# EAGLE design Steering_Board (EAGLE 9.6.2)
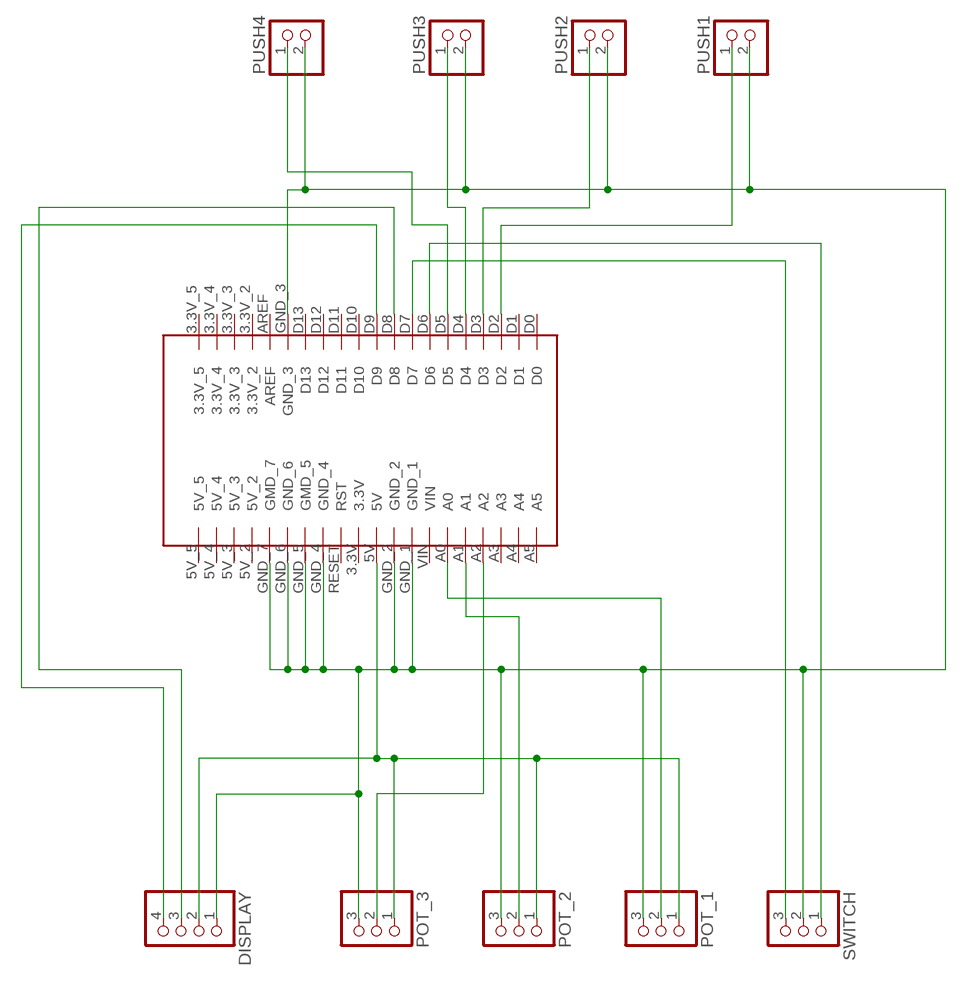
[diagram p0: schematic, sheet 1]

## Parts
2X40CONECTOR1  2X40_CONNECTOR  [2X40_PIN_CONNECTOR]
DISPLAY  PINHD-1X4  [1X04]
POT_1  PINHD-1X3  [1X03]
POT_2  PINHD-1X3  [1X03]
POT_3  PINHD-1X3  [1X03]
PUSH1  PINHD-1X2  [1X02]
PUSH2  PINHD-1X2  [1X02]
PUSH3  PINHD-1X2  [1X02]
PUSH4  PINHD-1X2  [1X02]
SWITCH  PINHD-1X3  [1X03]

## Nets
5V [GND, 5V]: 2X40CONECTOR1.5V DISPLAY.2 POT_1.1 POT_2.1 POT_3.1
DISPLAY_D8: 2X40CONECTOR1.D8 DISPLAY.3
DISPLAY_D9: 2X40CONECTOR1.D9 DISPLAY.4
GND [GND, 5V]: 2X40CONECTOR1.GND_1 2X40CONECTOR1.GND_2 2X40CONECTOR1.GND_3 2X40CONECTOR1.GND_4 2X40CONECTOR1.GND_5(GMD_5) 2X40CONECTOR1.GND_6 2X40CONECTOR1.GND_7(GMD_7) DISPLAY.1 POT_1.3 POT_2.3 POT_3.3 PUSH1.2 PUSH2.2 PUSH3.2 PUSH4.2 SWITCH.2
POT3_A2: 2X40CONECTOR1.A2 POT_3.2
POTEN1_A0: 2X40CONECTOR1.A0 POT_1.2
POTEN2_A1: 2X40CONECTOR1.A1 POT_2.2
PUSH1_D2: 2X40CONECTOR1.D2 PUSH1.1
PUSH2_D3: 2X40CONECTOR1.D3 PUSH2.1
PUSH3_D4: 2X40CONECTOR1.D4 PUSH3.1
PUSH4_D5: 2X40CONECTOR1.D5 PUSH4.1
SWITCH_D6: 2X40CONECTOR1.D6 SWITCH.1
SWITCH_D7: 2X40CONECTOR1.D7 SWITCH.3
Unconnected: 2X40CONECTOR1.3.3V 2X40CONECTOR1.3.3V_2 2X40CONECTOR1.3.3V_3 2X40CONECTOR1.3.3V_4 2X40CONECTOR1.3.3V_5 2X40CONECTOR1.5V_2 2X40CONECTOR1.5V_3 2X40CONECTOR1.5V_4 2X40CONECTOR1.5V_5 2X40CONECTOR1.A3 2X40CONECTOR1.A4 2X40CONECTOR1.A5 2X40CONECTOR1.AREF 2X40CONECTOR1.D0 2X40CONECTOR1.D1 2X40CONECTOR1.D10 2X40CONECTOR1.D11 2X40CONECTOR1.D12 2X40CONECTOR1.D13 2X40CONECTOR1.RESET(RST) 2X40CONECTOR1.VIN

## Library data of the parts
2X40CONECTOR1 = 2x40 Connector:2X40_CONNECTOR
DISPLAY = pinhead:PINHD-1X4: PIN HEADER
POT_1-POT_3 SWITCH = pinhead:PINHD-1X3: PIN HEADER
PUSH1-PUSH4 = pinhead:PINHD-1X2: PIN HEADER

## Net classes
0 default: width 0.5 mm, clearance 0.381 mm
1 GND, 5V: width 0.75 mm, clearance 0.381 mm

## Board
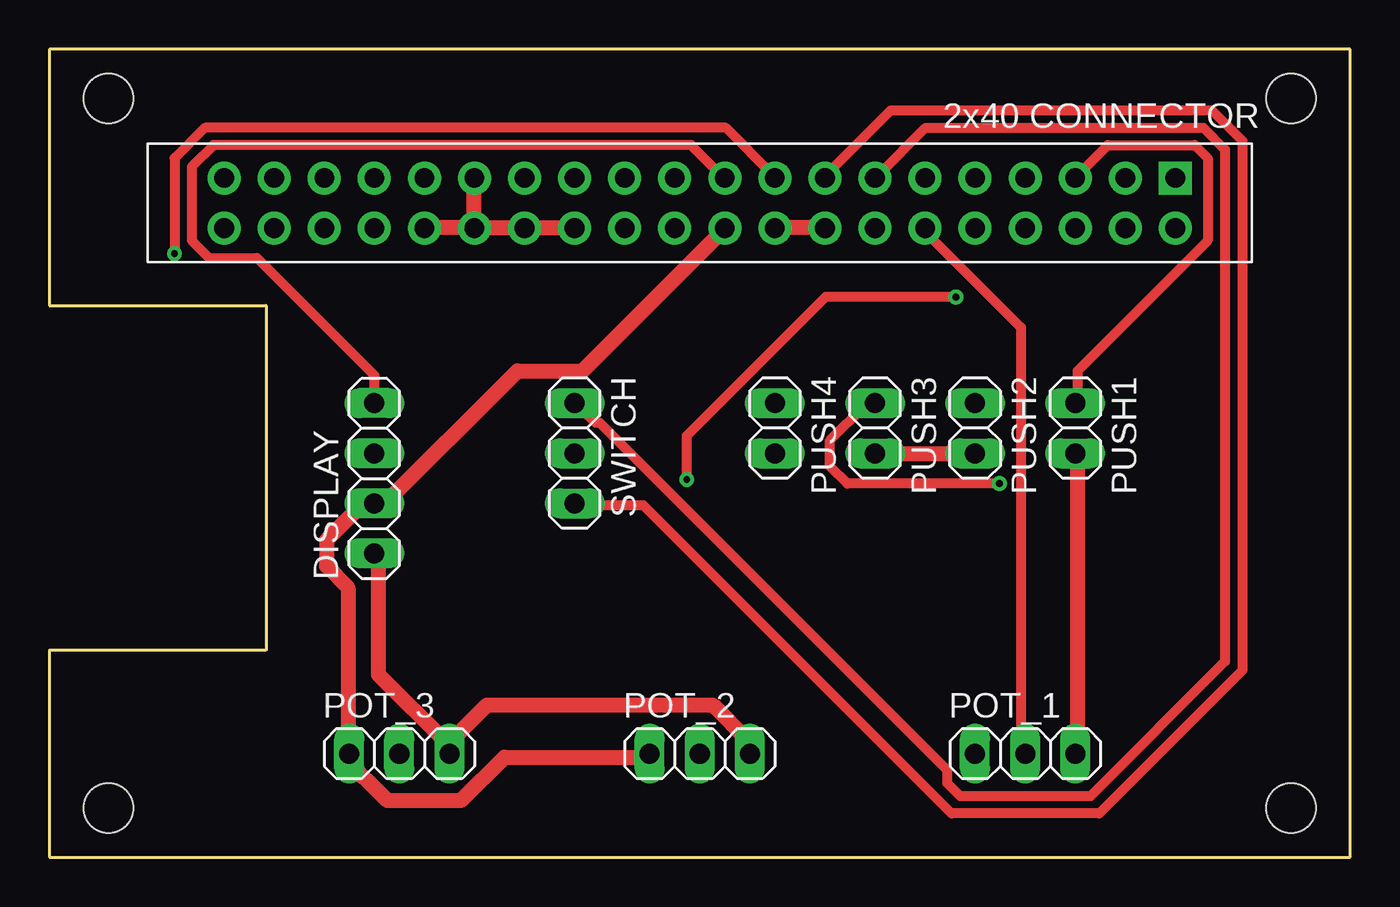
[diagram p1: board, top side]
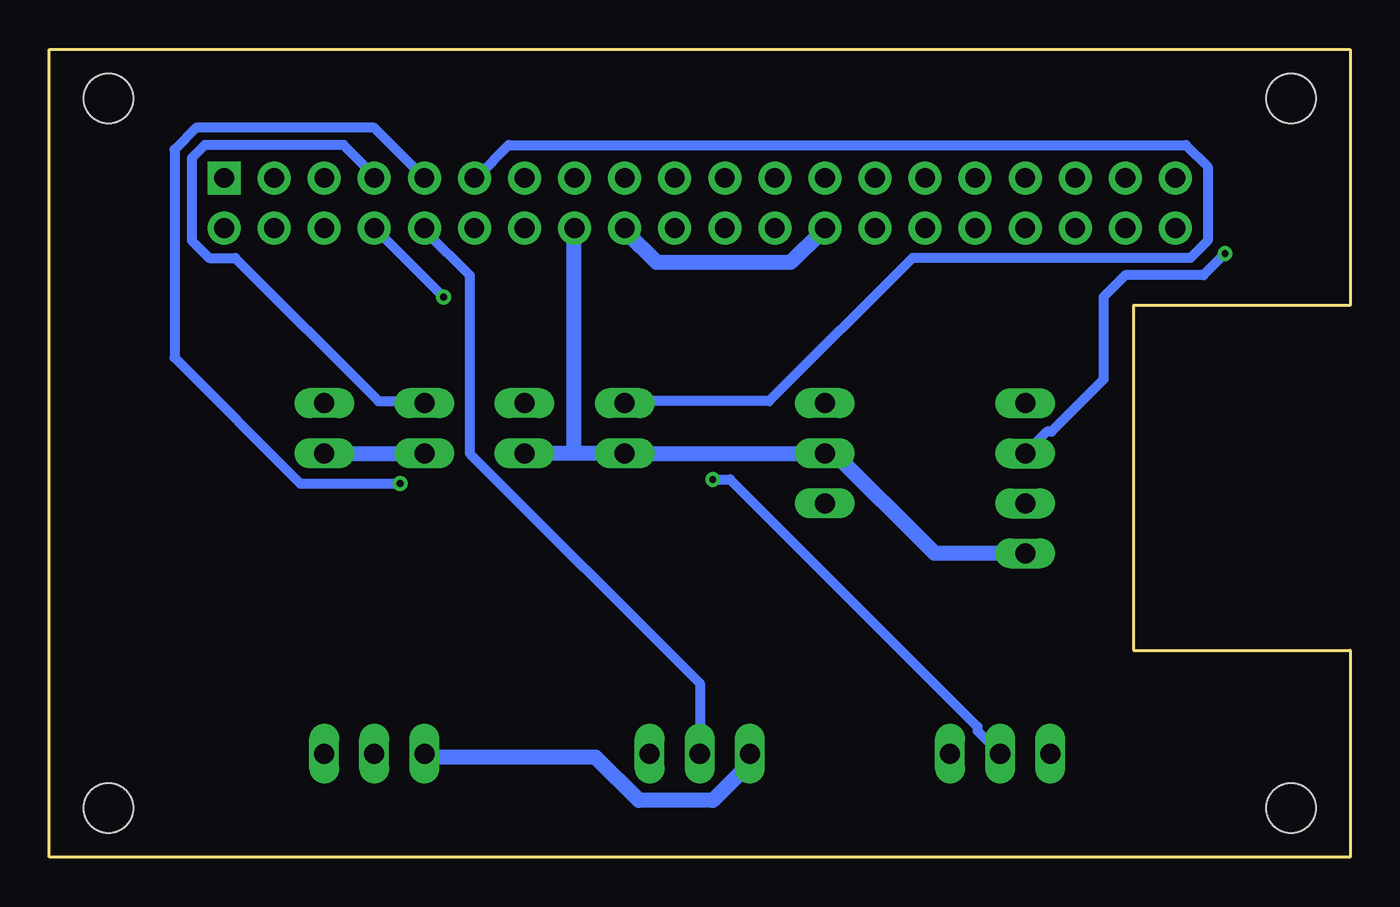
[diagram p2: board, bottom side, seen from below]

Size 66 x 41 mm. Coordinates in mm from the lower left corner, seen from the top.
Outline: 0,0 66,0 66,41 0,41 0,28 11,28 11,10.5 0,10.5 0,0
Copper layers (1*16): Top 0.035mm / dielectric 1.5mm / Bottom 0.035mm
Design rules "default": minimum track width 6mil, minimum drill 0.35mm, track to track 6mil, track to pad 6mil, pad to pad 6mil, via to via 6mil, smd to smd 6mil, copper to edge 40mil, drill to drill 6mil, minimum pad ring 10mil, minimum via ring 8mil, stop-mask expansion 4mil, vias tented up to drill 0mil, thermal gap 10mil
Holes 2.5 mm at 3,2.5 3,38.5 63,38.5 63,2.5

### Footprints (pad centres in the part's own frame; a part is rotated, then mirrored left to right if it is on the bottom)
2X40_PIN_CONNECTOR = drill 1 pad 1.676: 3.3V 22.86,0; 3.3V_2 7.62,2.54; 3.3V_3 5.08,2.54; 3.3V_4 2.54,2.54; 3.3V_5 0,2.54; 5V 25.4,0; 5V_2 7.62,0; 5V_3 5.08,0; 5V_4 2.54,0; 5V_5 0,0; A0 35.56,0; A1 38.1,0; A2 40.64,0; A3 43.18,0; A4 45.72,0; A5 48.26,0; AREF 10.16,2.54; D1 45.72,2.54; D2 43.18,2.54; D3 40.64,2.54; D4 38.1,2.54; D5 35.56,2.54; D6 33.02,2.54; D7 30.48,2.54; D8 27.94,2.54; D9 25.4,2.54; D10 22.86,2.54; D11 20.32,2.54; D12 17.78,2.54; D13 15.24,2.54; GND_1 30.48,0; GND_2 27.94,0; GND_3 12.7,2.54; GND_4 17.78,0; GND_5 15.24,0; GND_6 12.7,0; GND_7 10.16,0; RESET 20.32,0; VIN 33.02,0 | drill 1 pad 1.676 square: D0 48.26,2.54
1X04 = drill 1.016 long: 1 -3.81,0; 2 -1.27,0; 3 1.27,0; 4 3.81,0
1X03 = drill 1.016 long: 1 -2.54,0; 2 0,0; 3 2.54,0
1X02 = drill 1.016 long: 1 -1.27,0; 2 1.27,0

### Placement (x,y rotation side)
2X40CONECTOR1  8.87,31.93 0 top
DISPLAY  16.49,19.23 90 top
POT_1  49.51,5.26 0 top
POT_2  33,5.26 0 top
POT_3  17.76,5.26 0 top
PUSH1  52.05,21.77 270 top
PUSH2  46.97,21.77 270 top
PUSH3  41.89,21.77 270 top
PUSH4  36.81,21.77 270 top
SWITCH  26.65,20.5 270 top

### Tracks (layer width: path | path; a pad name or v marks a point on that pad's centre or on a via)
5V
  Top 0.75: POT_2.1 30.36,5.08 23.09,5.08 20.89,2.88 17.14,2.88 14.94,5.08 POT_3.1 15.16,5.3 15.16,13.67 14.06,14.77 14.06,16.09 15.82,17.86 16.48,17.86 DISPLAY.2 16.7,17.64 23.75,24.68 27.05,24.68 34.1,31.73 2X40CONECTOR1.5V
  Bottom 0.75: POT_1.1 46.88,5.08 38.29,5.08 36.08,2.88 32.34,2.88 30.58,4.64 30.58,5.08 POT_2.1
DISPLAY_D8  (via drill 0.35)
  Top 0.5: v6.35,30.63 6.35,35.48 7.89,37.02 34.32,37.02 36.74,34.6 2X40CONECTOR1.D8
  Bottom 0.5: v6.35,30.63 7.45,29.53 11.42,29.53 12.52,28.43 12.52,24.24 15.16,21.6 15.38,21.6 DISPLAY.3
DISPLAY_D9
  Top 0.5: DISPLAY.4 16.48,23.14 16.48,24.46 10.54,30.41 8.11,30.41 7.23,31.29 7.23,35.04 8.33,36.14 32.56,36.14 34.1,34.6 2X40CONECTOR1.D9
GND
  Top 0.75: DISPLAY.1 16.7,15.21 16.7,9.27 20.23,5.74 20.23,5.3 POT_3.3 20.45,5.96 22.21,7.73 33.66,7.73 35.42,5.96 35.42,5.3 POT_2.3 | POT_1.3 52.16,5.3 52.16,20.5 PUSH1.2 | 2X40CONECTOR1.GND_7 19.12,31.95 21.55,31.95 2X40CONECTOR1.GND_6 | 2X40CONECTOR1.GND_6 21.77,31.95 23.97,31.95 2X40CONECTOR1.GND_5 24.41,31.95 26.61,31.95 2X40CONECTOR1.GND_4 | 2X40CONECTOR1.GND_3 21.55,34.38 21.55,32.17 2X40CONECTOR1.GND_6 | 2X40CONECTOR1.GND_2 36.97,31.95 39.17,31.95 2X40CONECTOR1.GND_1 | PUSH3.2 PUSH2.2
  Bottom 0.75: PUSH1.2 PUSH2.2 | 39.39,20.5 PUSH4.2 SWITCH.2 26.39,20.72 21.11,15.43 16.7,15.43 DISPLAY.1 | 39.39,20.5 PUSH3.2 | 39.39,20.5 39.39,31.73 2X40CONECTOR1.GND_1 | 2X40CONECTOR1.GND_4 26.83,31.73 28.38,30.19 35.2,30.19 36.74,31.73 2X40CONECTOR1.GND_2
POT3_A2  (via drill 0.35)
  Top 0.5: v32.34,19.18 32.34,21.38 39.39,28.43 v45.99,28.43
  Bottom 0.5: POT_3.2 18.9,6.4 18.9,6.62 31.46,19.18 v32.34,19.18 | v45.99,28.43 49.3,31.73 2X40CONECTOR1.A2
POTEN1_A0
  Top 0.5: POT_1.2 49.3,5.3 49.3,26.89 44.45,31.73 2X40CONECTOR1.A0
POTEN2_A1
  Bottom 0.5: POT_2.2 33,8.83 44.67,20.5 44.67,29.53 46.88,31.73 2X40CONECTOR1.A1
PUSH1_D2
  Top 0.5: PUSH1.1 52.16,23.14 52.16,24.68 58.77,31.29 58.77,35.48 58.11,36.14 53.7,36.14 52.16,34.6 2X40CONECTOR1.D2
PUSH2_D3
  Bottom 0.5: PUSH2.1 47.1,23.14 49.3,23.14 56.57,30.41 57.89,30.41 58.77,31.29 58.77,35.48 58.11,36.14 51.06,36.14 49.52,34.6 2X40CONECTOR1.D3
PUSH3_D4  (via drill 0.35)
  Top 0.5: v48.2,18.96 40.49,18.96 39.61,19.84 39.61,21.16 41.37,22.92 41.81,22.92 PUSH3.1
  Bottom 0.5: v48.2,18.96 53.26,18.96 59.65,25.35 59.65,35.92 58.55,37.02 49.52,37.02 2X40CONECTOR1.D4
PUSH4_D5
  Bottom 0.5: PUSH4.1 36.74,23.14 29.48,23.14 22.21,30.41 8.11,30.41 7.23,31.29 7.23,35.04 8.33,36.14 42.69,36.14 44.23,34.6 2X40CONECTOR1.D5
SWITCH_D6
  Top 0.5: SWITCH.1 26.83,22.92 27.71,22.04 27.93,22.04 45.55,4.42 45.55,3.76 46.22,3.1 52.82,3.1 59.65,9.93 59.65,35.92 58.55,37.02 44.45,37.02 42.03,34.6 2X40CONECTOR1.D6
SWITCH_D7
  Top 0.5: SWITCH.3 26.83,17.86 30.14,17.86 45.77,2.22 53.26,2.22 60.53,9.49 60.53,36.36 58.99,37.9 42.69,37.9 39.39,34.6 2X40CONECTOR1.D7